# Altium project Evaluation Board.PrjPCB (part 3 of 3)

## Sheet DVI-I.SchDoc: Evaluation Board 3.2
size A3; Organization: Toradex AG; Address1: Altsagenstrasse 5; Address2: Horw; Address3: 6048; Address4: Switzerland; DocumentNumber: 18; Revision: V3.2; SheetNumber: 18; SheetTotal: 23; PageSetup: Record=PageOptions|CenterHorizontal=True|CenterVertical=True|PrintScale=0.73|XCorrection=1.00|YCorrection=1.00|PrintKind=0|BorderSize=5000000|LeftOffset=0|BottomOffset=0|Orientation=2|PaperLength=1000|PaperWidth=1000|Scale=100|PaperSource=7|PrintQuality=-4|MediaType=1|DitherType=10|PaperKind=A4|PrintScaleMode=1
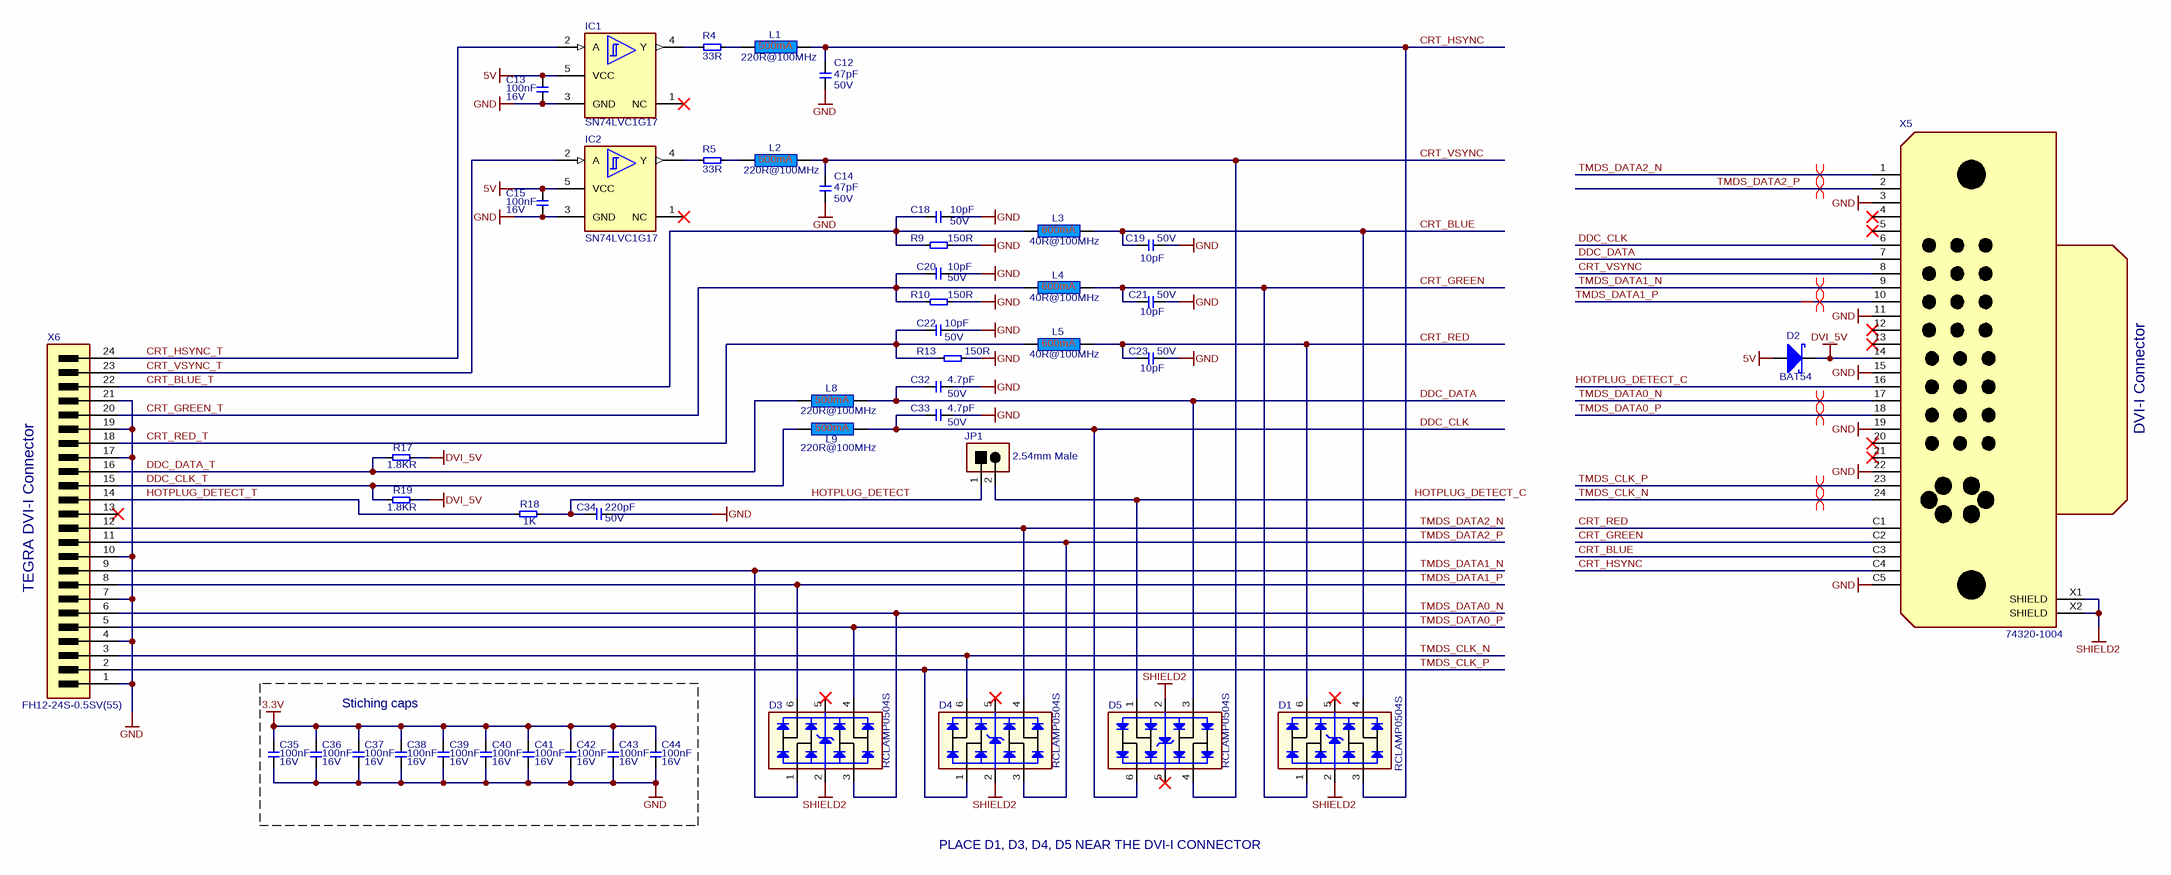
[diagram p18: DVI-I.SchDoc]

### Parts
C12  Rating: 50V  [T_CAPC0603X33N]  (hidden comment: 47pF)
C13  Rating: 16V  [T_CAPC0603X33N]  (hidden comment: 100nF)
C14  Rating: 50V  [T_CAPC0603X33N]  (hidden comment: 47pF)
C15  Rating: 16V  [T_CAPC0603X33N]  (hidden comment: 100nF)
C18  Rating: 50V  [T_CAPC0603X33N]  (hidden comment: 10pF)
C19  Rating: 50V  [T_CAPC0603X33N]  (hidden comment: 10pF)
C20  Rating: 50V  [T_CAPC0603X33N]  (hidden comment: 10pF)
C21  Rating: 50V  [T_CAPC0603X33N]  (hidden comment: 10pF)
C22  Rating: 50V  [T_CAPC0603X33N]  (hidden comment: 10pF)
C23  Rating: 50V  [T_CAPC0603X33N]  (hidden comment: 10pF)
C32  Rating: 50V  [T_CAPC0603X33N]  (hidden comment: 4.7pF)
C33  Rating: 50V  [T_CAPC0603X33N]  (hidden comment: 4.7pF)
C34  Rating: 50V  [T_CAPC0603X33N]  (hidden comment: 220pF)
C35  Rating: 16V  [T_CAPC0603X33N]  (hidden comment: 100nF)
C36  Rating: 16V  [T_CAPC0603X33N]  (hidden comment: 100nF)
C37  Rating: 16V  [T_CAPC0603X33N]  (hidden comment: 100nF)
C38  Rating: 16V  [T_CAPC0603X33N]  (hidden comment: 100nF)
C39  Rating: 16V  [T_CAPC0603X33N]  (hidden comment: 100nF)
C40  Rating: 16V  [T_CAPC0603X33N]  (hidden comment: 100nF)
C41  Rating: 16V  [T_CAPC0603X33N]  (hidden comment: 100nF)
C42  Rating: 16V  [T_CAPC0603X33N]  (hidden comment: 100nF)
C43  Rating: 16V  [T_CAPC0603X33N]  (hidden comment: 100nF)
C44  Rating: 16V  [T_CAPC0603X33N]  (hidden comment: 100nF)
D1  RCLAMP0504S  [T_SOT95P285X90-6N]
D2  BAT54  [SOT95P230X110-3N]
D3  RCLAMP0504S  [T_SOT95P285X90-6N]
D4  RCLAMP0504S  [T_SOT95P285X90-6N]
D5  RCLAMP0504S  [T_SOT95P285X90-6N]
IC1  SN74LVC1G17  [SOT65P210X110-5N]
IC2  SN74LVC1G17  [SOT65P210X110-5N]
JP1  TSW-101-07-G-D  [T_Samtec_TSW-101-07-G-D]  (value not drawn)
L1  220R@100MHz  [INDC1608X95N]
L2  220R@100MHz  [INDC1608X95N]
L3  40R@100MHz  [INDC1608X95N]
L4  40R@100MHz  [INDC1608X95N]
L5  40R@100MHz  [INDC1608X95N]
L8  220R@100MHz  [INDC1608X95N]
L9  220R@100MHz  [INDC1608X95N]
R4  33R  [t_RESC0603X30N]
R5  33R  [t_RESC0603X30N]
R9  150R  [t_RESC0603X30N]
R10  150R  [t_RESC0603X30N]
R13  150R  [t_RESC0603X30N]
R17  value 1.8KR  [t_RESC0603X30N]  (hidden comment: 1.8K)
R18  1K  [t_RESC0603X30N]
R19  value 1.8KR  [t_RESC0603X30N]  (hidden comment: 1.8K)
X5  Manufacturer Part No.: 74320-1004  [T_MOLEX_74320-1004]  (hidden comment: CON-Molex-74320-1004-31)
X6  FH12-24S-0.5SV(55)  [T_Hirose_FH12-24S-0.5SV(55)]

### Blocks framed on the sheet
Stiching caps: C35-C44

### Nets
3.3V: C35.2 C36.2 C37.2 C38.2 C39.2 C40.2 C41.2 C42.2 C43.2 C44.2
5V: C13.2 C15.2 D2.1 IC1.5(VCC) IC2.5(VCC)
DVI_5V: D2.3 R17.1 R19.1 X5.14(VDD_DVI)
GND: C12.2 C13.1 C14.2 C15.1 C18.2 C19.2 C20.2 C21.2 C22.2 C23.2 C32.2 C33.2 C34.2 C35.1 C36.1 C37.1 C38.1 C39.1 C40.1 C41.1 C42.1 C43.1 C44.1 IC1.3(GND) IC2.3(GND) R9.2 R10.2 R13.2 X5.3(GND) X5.11(GND) X5.15(GND) X5.19(GND) X5.22(GND) X5.C5(GND) X6.1(GND) X6.4(GND) X6.7(GND) X6.10(GND) X6.17(GND) X6.19(GND) X6.21(GND)
SHIELD2: D1.2 D3.2 D4.2 D5.2 X5.X1(SHIELD) X5.X2(SHIELD)
CRT_BLUE: C19.1 D1.4 L3.2 X5.C3(CRT_BLUE)
CRT_BLUE_T: C18.1 L3.1 R9.1 X6.22(CRT_BLUE)
CRT_GREEN: C21.1 D1.1 L4.2 X5.C2(CRT_GREEN)
CRT_GREEN_T: C20.1 L4.1 R10.1 X6.20(CRT_GREEN)
CRT_HSYNC: C12.1 D1.3 L1.2 X5.C4(CRT_HSYNC)
CRT_HSYNC_T: IC1.2(A) X6.24(CRT_HSYNC)
CRT_RED: C23.1 D1.6 L5.2 X5.C1(CRT_RED)
CRT_RED_T: C22.1 L5.1 R13.1 X6.18(CRT_RED)
CRT_VSYNC: C14.1 D5.4 L2.2 X5.8(CRT_VSYNC)
CRT_VSYNC_T: IC2.2(A) X6.23(CRT_VSYNC)
DDC_CLK: C33.1 D5.6 L9.2 X5.6(DDC_CLK)
DDC_CLK_T: L9.1 R19.2 X6.15(DDC_CLK)
DDC_DATA: C32.1 D5.3 L8.2 X5.7(DDC_DATA)
DDC_DATA_T: L8.1 R17.2 X6.16(DDC_DATA)
HOTPLUG_DETECT: C34.1 JP1.1 R18.2
HOTPLUG_DETECT_C: D5.1 JP1.2 X5.16(HOTPLUG_DETECT)
HOTPLUG_DETECT_T: R18.1 X6.14(HOTPLUG_DETECT)
TMDS_CLK_N: D4.6 X5.24(TMDS_CLK_N) X6.3(TMDS_CLK_N)
TMDS_CLK_P: D4.1 X5.23(TMDS_CLK_P) X6.2(TMDS_CLK_P)
TMDS_DATA0_N: D3.3 X5.17(TMDS_DATA0_N) X6.6(TMDS_DATA0_N)
TMDS_DATA0_P: D3.4 X5.18(TMDS_DATA0_P) X6.5(TMDS_DATA0_P)
TMDS_DATA1_N: D3.1 X5.9(TMDS_DATA1_N) X6.9(TMDS_DATA1_N)
TMDS_DATA1_P: D3.6 X5.10(TMDS_DATA1_P) X6.8(TMDS_DATA1_P)
TMDS_DATA2_N: D4.4 X5.1(TMDS_DATA2_N) X6.12(TMDS_DATA2_N)
TMDS_DATA2_P: D4.3 X5.2(TMDS_DATA2_P) X6.11(TMDS_DATA2_P)
NetIC1_4: IC1.4(Y) R4.1
NetIC2_4: IC2.4(Y) R5.1
NetL1_1: L1.1 R4.2
NetL2_1: L2.1 R5.2

Not connected (* = marked no-connect by the designer): D1 5*; D3 5*; D4 5*; D5 5*; IC1 1(NC)*; IC2 1(NC)*; X5 4(TMDS_DATA4_N)* 5(TMDS_DATA4_P)* 12(TMDS_DATA3_N)* 13(TMDS_DATA3_P)* 20(TMDS_DATA5_N)* 21(TMDS_DATA5_P)*; X6 13(VDD)*

### Layout directives
differential pair: TMDS_CLK_N, TMDS_CLK_P, TMDS_DATA0_N, TMDS_DATA0_P, TMDS_DATA1_N, TMDS_DATA1_P, TMDS_DATA2_N, TMDS_DATA2_P

### Notes on the sheet
- DVI-I Connector
- (near JP1) 2.54mm Male
- (near X6) TEGRA DVI-I Connector
- PLACE D1, D3, D4, D5 NEAR THE DVI-I CONNECTOR
- Title
- Size:
- Date:
- A3
- Number:
- Time:
- Revision:
- Sheet
- of
- File:

### Library data of the parts
C12 C14 = C-NP0-47pF-50V-10%-0603: Capacitor Ceramic NP0 47pF 50V 10% 0603; Tolerance: 10%; Type: NP0; Value: 47pF
C13 C15 C35-C44 = C-X7R-100nF-16V-10%-0603: Capacitor Ceramic X7R 100nF 16V 10% 0603; Tolerance: 10%; Type: X7R; Value: 100nF
C18-C23 = C-NP0-10pF-50V-10%-0603: Capacitor Ceramic NP0 10pF 50V 10% 0603; Tolerance: 10%; Type: NP0; Value: 10pF
C32 C33 = C-NP0-4.7pF-25V-10%-0603: Capacitor Ceramic NP0  4.7pF 25V 10% 0603; Tolerance: 10%; Type: NP0; Value: 4.7pF
C34 = C-X7R-220pF-50V-20%-0603: Capacitor Ceramic X7R 220pF 50V 20% 0603; Tolerance: 20%; Type: X7R; Value: 220pF
D1 D3-D5 = D-Semtech-RClamp0504S: TVS Array low cap; Manufacturer Name: Semtech; Manufacturer Part No.: RCLAMP0504S
D2 = D-Philips-BAT54-Schottky: BAT54 Schottky Diode; Manufacturer Name: Philips; Manufacturer Part No.: BAT54
IC1 IC2 = IC-TI-SN74LVC1G17: Single Schmitt-Trigger Buffer; Manufacturer Name: Texas Instruments; Manufacturer Part No.: SN74LVC1G17
JP1 = CON-Samtec-TSW-101-07-G-D: Header male, 1x2 Pins, 2.54 mm pitch; Manufacturer Name: Samtec; Pitch: 2.54 mm; No. of ways: 1x2; Manufacturer Part no.: TSW-101-07-G-D
L1 L2 L8 L9 = L-220R@100MHz-500mA-25%-0603: 220R@100MHz 500mA EMI FILTER; Tolerance: 25%; Rating: 500mA; Value: 220R@100MHz
L3-L5 = L-TDK-MMZ1608S400A-40R@100MHz-600mA-25%-0603: 40R@100MHz 600mA EMI FILTER; Manufacturer Name: TDK; Tolerance: 25%; Rating: 600mA; Manufacturer Part No.: MMZ1608S400A; Value: 40R@100MHz
R4 R5 = R-33R-63mW-5%-0603: Resistor 33 ohm 63mW 5% 0603; Rating: 63mW; Tolerance: 5%; Value: 33R
R9 R10 R13 = R-150R-63mW-1%-0603: Resistor 150 ohm 63mW 1% 0603; Rating: 63mW; Tolerance: 1%; Value: 150R
R17 R19 = R-1.8KR-63mW-5%-0603: Resistor 1.8 Kohm 63mW 5% 0603; Rating: 63mW; Tolerance: 5%
R18 = R-1KR-63mW-5%-0603: Resistor 1 Kohm 63mW 5% 0603; Rating: 63mW; Tolerance: 5%; Value: 1K
X5 = CON-Molex-74320-1004-31: DVI Connector; Manufacturer Name: Molex; No. of ways: 31
X6 = CON-Hirose-FH12-24S-0.5SV(55)-0.5mm: 0.50mm Pitch FFC/FPC Vertical DVI Connector; Manufacturer Name: Hirose; No. of ways: 24; Pitch: 0.5mm; Manufacturer Part No.: FH12-24S-0.5SV(55)

## Sheet RevisionHistory.SchDoc: Evaluation Board 3.2
size A3; Organization: Toradex AG; Address1: Altsagenstrasse 5; Address2: Horw; Address3: 6048; Address4: Switzerland; DocumentNumber: 1; Revision: V3.2; SheetNumber: 1; SheetTotal: 23
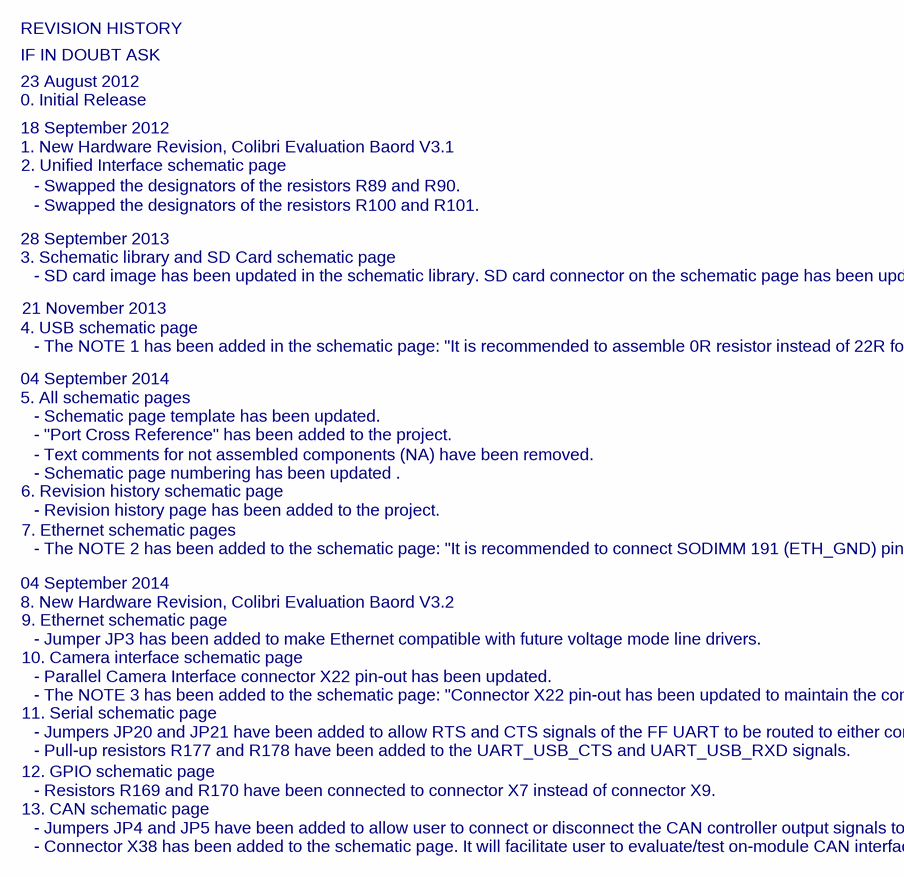
[diagram p19: RevisionHistory.SchDoc]

### Notes on the sheet
- REVISION HISTORY
- IF IN DOUBT ASK
- 0. Initial Release
- 18 September 2012
- 23 August 2012
- 1. New Hardware Revision, Colibri Evaluation Baord V3.1
- 2. Unified Interface schematic page
- - Swapped the designators of the resistors R89 and R90.
- 28 September 2013
- 3. Schematic library and SD Card schematic page
- - Swapped the designators of the resistors R100 and R101.
- 4. USB schematic page
- 21 November 2013
- - SD card image has been updated in the schematic library. SD card connector on the schematic page has been updated to reflect the library changes.
- 04 September 2014
- 5. All schematic pages
- - The NOTE 1 has been added in the schematic page: "It is recommended to assemble 0R resistor instead of 22R for R102 and R103".
- - Schematic page template has been updated.
- - "Port Cross Reference" has been added to the project.
- - Text comments for not assembled components (NA) have been removed.
- 6. Revision history schematic page
- 7. Ethernet schematic pages
- - Revision history page has been added to the project.
- - Schematic page numbering has been updated .
- 8. New Hardware Revision, Colibri Evaluation Baord V3.2
- - The NOTE 2 has been added to the schematic page: "It is recommended to connect SODIMM 191 (ETH_GND) pin directly to the GND".
- 9. Ethernet schematic page
- 10. Camera interface schematic page
- - Jumper JP3 has been added to make Ethernet compatible with future voltage mode line drivers.
- 11. Serial schematic page
- - Jumpers JP20 and JP21 have been added to allow RTS and CTS signals of the FF UART to be routed to either connector X27 or connector X25.
- - Parallel Camera Interface connector X22 pin-out has been updated.
- - The NOTE 3 has been added to the schematic page: "Connector X22 pin-out has been updated to maintain the compatibility with Apalis Evaluation Board".
- 12. GPIO schematic page
- - Resistors R169 and R170 have been connected to connector X7 instead of connector X9.
- - Pull-up resistors R177 and R178 have been added to the UART_USB_CTS and UART_USB_RXD signals.
- 13. CAN schematic page
- - Jumpers JP4 and JP5 have been added to allow user to connect or disconnect the CAN controller output signals to the CAN transceiver.
- - Connector X38 has been added to the schematic page. It will facilitate user to evaluate/test on-module CAN interface.
- Title
- Size:
- Date:
- A3
- Number:
- Time:
- Revision:
- Sheet
- of
- File:

## Nets that join several sheets
3.3V: LVDS (11 pins), Generic_Display (JP24.1 L47.1), SDCard (7 pins), Extension (8 pins), Ethernet (L10.1 X17.9 X17.12), USB (19 pins), RTC (R45.2 R46.2 R47.2 R48.2), VGA (R14.1 R15.1), Camera_Interface (6 pins), Power_Switch (7 pins), CAN (8 pins), JTAG (5 pins), LEDs_Switches (11 pins), GPIOs (R169.2 R170.2), Unified_Interface (5 pins), DVI-I (10 pins)
5V: LVDS (L12.1), Generic_Display (JP24.3 L44.1), Extension (X3.A25 X3.B19 X3.B29 X3.C25), USB (6 pins), VGA (5 pins), Camera_Interface (C174.2 X22.24), CAN (C164.1 IC20.3), DVI-I (5 pins)
AUDIO_AGND: Audio (10 pins), Analog_IOs (X14.2 X14.4 X14.6 X14.8)
GND: LVDS (23 pins), Generic_Display (17 pins), SDCard (9 pins), Extension (7 pins), Ethernet (L11.1), Audio (C3.1 C8.1 C11.2), USB (50 pins), RTC (7 pins), VGA (48 pins), Analog_IOs (8 pins), Camera_Interface (5 pins), Power_Switch (23 pins), CAN (9 pins), JTAG (19 pins), LEDs_Switches (19 pins), Unified_Interface (8 pins), DVI-I (41 pins)
SHIELD2: Ethernet (X17.8 X17.S1 X17.S2), USB (18 pins), VGA (D15.2 D16.2 X24.S1 X24.S2), DVI-I (6 pins)
BL_ON: LVDS (R29.1 X18.17), Generic_Display (X20.37 X23.3), VGA (R12.1), Unified_Interface (X34.5)
I2C_SCL: Extension (X3.C28), USB (R83.1), RTC (IC7.6 R46.1 X7.48 X8.B48), Camera_Interface (X22.15)
I2C_SDA: Extension (X3.A29), USB (R81.1), RTC (IC7.5 R45.1 X7.47 X8.B47), Camera_Interface (X22.16)
LCD_BIAS: LVDS (IC4.25), Generic_Display (X20.27), VGA (IC3.11), Unified_Interface (X34.32)
LCD_D_0: LVDS (IC4.13), Generic_Display (X20.20), VGA (IC3.18), Unified_Interface (X34.13)
LCD_D_1: LVDS (IC4.15), Generic_Display (X20.21), VGA (IC3.19), Unified_Interface (X34.12)
LCD_D_2: LVDS (IC4.16), Generic_Display (X20.22), VGA (IC3.20), Unified_Interface (X34.11)
LCD_D_3: LVDS (IC4.18), Generic_Display (X20.23), VGA (IC3.21), Unified_Interface (X34.10)
LCD_D_4: LVDS (IC4.19), Generic_Display (X20.24), VGA (IC3.22), Unified_Interface (X34.9)
LCD_D_5: LVDS (IC4.20), Generic_Display (X20.25), VGA (IC3.23), Unified_Interface (X34.8)
LCD_D_6: LVDS (IC4.4), Generic_Display (X20.13), VGA (IC3.5), Unified_Interface (X34.20)
LCD_D_7: LVDS (IC4.6), Generic_Display (X20.14), VGA (IC3.6), Unified_Interface (X34.19)
LCD_D_8: LVDS (IC4.7), Generic_Display (X20.15), VGA (IC3.7), Unified_Interface (X34.18)
LCD_D_9: LVDS (IC4.9), Generic_Display (X20.16), VGA (IC3.8), Unified_Interface (X34.17)
LCD_D_10: LVDS (IC4.10), Generic_Display (X20.17), VGA (IC3.9), Unified_Interface (X34.16)
LCD_D_11: LVDS (IC4.12), Generic_Display (X20.18), VGA (IC3.10), Unified_Interface (X34.15)
LCD_D_12: LVDS (IC4.44), Generic_Display (X20.6), VGA (IC3.43), Unified_Interface (X34.27)
LCD_D_13: LVDS (IC4.45), Generic_Display (X20.7), VGA (IC3.44), Unified_Interface (X34.26)
LCD_D_14: LVDS (IC4.47), Generic_Display (X20.8), VGA (IC3.45), Unified_Interface (X34.25)
LCD_D_15: LVDS (IC4.48), Generic_Display (X20.9), VGA (IC3.46), Unified_Interface (X34.24)
LCD_D_16: LVDS (IC4.1), Generic_Display (X20.10), VGA (IC3.47), Unified_Interface (X34.23)
LCD_D_17: LVDS (IC4.3), Generic_Display (X20.11), VGA (IC3.48), Unified_Interface (X34.22)
LCD_FCLK_RD: LVDS (IC4.23), Generic_Display (X20.4), VGA (IC26.2), Unified_Interface (X34.31)
LCD_LCLK_A0: LVDS (IC4.22), Generic_Display (X20.3), VGA (IC25.2), Unified_Interface (X34.30)
LCD_PCLK_WR: LVDS (IC4.26), Generic_Display (X20.2), VGA (IC3.24), Unified_Interface (X34.28)
OE#: Extension (RA26.8 X3.C26), Power_Switch (R146.2)
PWM_A: Analog_IOs (R99.1 X11.A26 X12.26), Unified_Interface (X34.6)
RESET_OUT#: Extension (X3.B32), USB (IC14.26), Power_Switch (IC22.1 RA30.6 T7.2), CAN (IC18.19), Unified_Interface (R110.1)
SODIMM_59: Analog_IOs (RA29.8 X10.26 X11.B26), Camera_Interface (X22.12)
SODIMM_67: Analog_IOs (RA29.5 X10.30 X11.B30), Camera_Interface (X22.11)
SODIMM_135: Extension (RA28.6 X10.40 X11.B40), USB (JP2.1)
SSP_FRM: Extension (X3.A30), CAN (IC18.18 X11.A32 X12.32)
SSP_RXD: Extension (X3.C30), CAN (IC18.17 X11.A34 X12.34)
SSP_SCLK: Extension (X3.C29), CAN (IC18.14 X11.A33 X12.33)
SSP_TXD: Extension (X3.B30), CAN (IC18.16 X11.A35 X12.35)
TOUCH_TSMX: Generic_Display (C146.2 X1.16 X16.3 X20.34), Unified_Interface (X34.38)
TOUCH_TSMY: Generic_Display (C145.2 X1.20 X16.2 X20.33), Unified_Interface (X34.39)
TOUCH_TSPX: Generic_Display (C148.2 X1.14 X16.5 X20.36), Unified_Interface (X34.40)
TOUCH_TSPY: Generic_Display (C147.2 X1.18 X16.4 X20.35), Unified_Interface (X34.37)
TOUCH_WIPER: Generic_Display (C149.2 X16.6 X20.50), Analog_IOs (R95.2)

## Assembly variants
Evaluation_Board_V03.0.001: not fitted C3 C8 C11 C70 C86 C90 C91 C154 C166 C168 JP18 JP25 L46 MECH1 MECH2 MECH4 MECH5 MECH6 MECH7 MECH8 MECH9 R14 R16 R26 R28 R30 R39 R57 R58 R81 R83 R84 R89 R91 R93 R100 R106 R111 R112 R113 R114 R115 R116 R156 R157 R184 R185 R186 R190 X23 X37
Evaluation_Board_V03.1.001: not fitted C3 C8 C11 C70 C86 C90 C91 C154 C166 C168 C169 JP18 JP25 L46 R14 R16 R26 R28 R30 R39 R57 R58 R81 R83 R84 R90 R91 R101 R106 R111 R112 R113 R114 R115 R116 R156 R157 R184 R185 R186 R190 X23 X37
Evaluation_Board_V03.2.001: not fitted C3 C8 C11 C70 C86 C90 C91 C154 C166 C168 C169 JP18 JP25 L46 R14 R16 R26 R28 R30 R39 R57 R58 R81 R83 R84 R90 R91 R101 R106 R111 R112 R113 R114 R115 R116 R156 R157 R184 R185 R186 R190 X23 X37